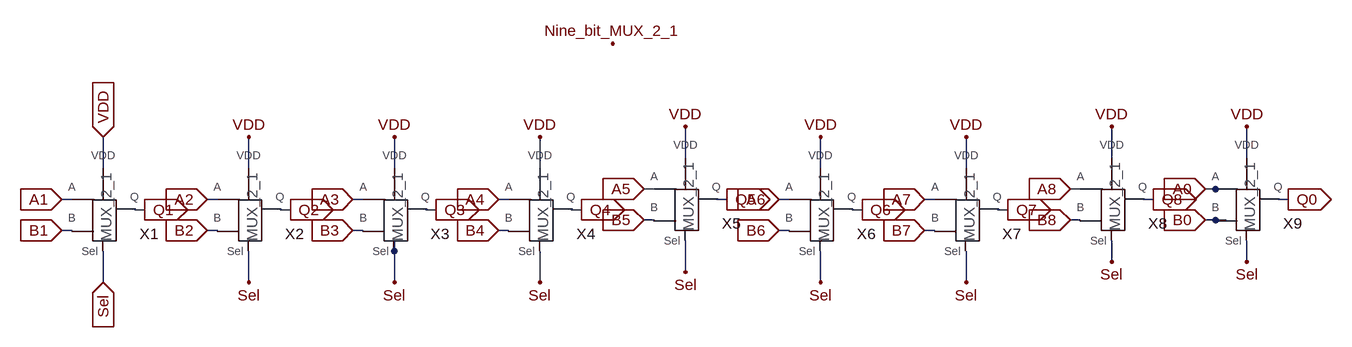
[diagram p0: schematic Mux_2_9bit_1.asc]
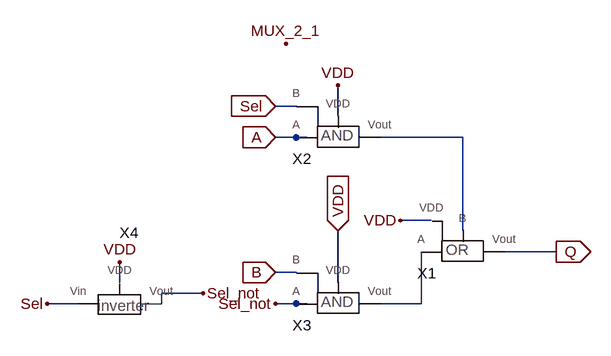
[diagram p1: sub-circuit mux_2_1.asc]
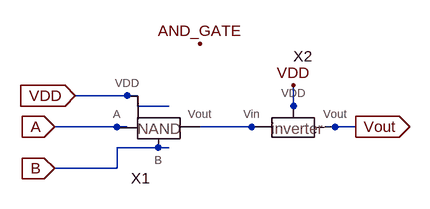
[diagram p2: sub-circuit and_gate.asc]
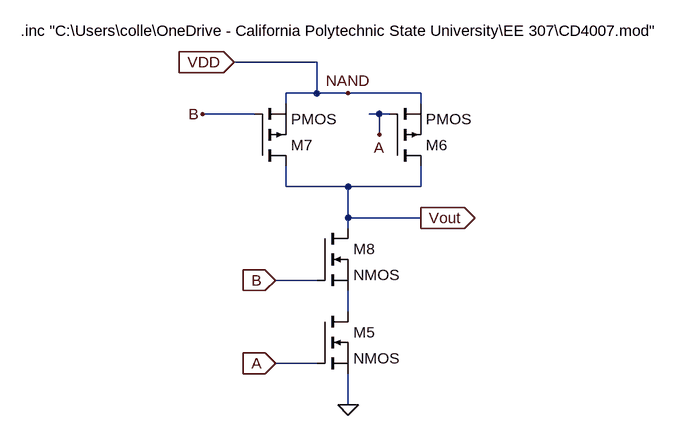
[diagram p3: sub-circuit nand_gate.asc]
Mux_2_9bit_1.asc, the LTspice schematic file:
Version 4
SHEET 1 2028 680
WIRE 1008 -208 1008 -256
WIRE 1664 -208 1664 -256
WIRE 1872 -208 1872 -256
WIRE 112 -192 112 -240
WIRE 336 -192 336 -240
WIRE 560 -192 560 -240
WIRE 784 -192 784 -240
WIRE 1216 -192 1216 -240
WIRE 1440 -192 1440 -240
WIRE 960 -160 944 -160
WIRE 1616 -160 1600 -160
WIRE 1824 -160 1808 -160
WIRE 1840 -160 1824 -160
WIRE 64 -144 48 -144
WIRE 288 -144 272 -144
WIRE 512 -144 496 -144
WIRE 736 -144 720 -144
WIRE 1072 -144 1056 -144
WIRE 1168 -144 1152 -144
WIRE 1392 -144 1376 -144
WIRE 1728 -144 1712 -144
WIRE 1936 -144 1920 -144
WIRE 176 -128 160 -128
WIRE 400 -128 384 -128
WIRE 624 -128 608 -128
WIRE 848 -128 832 -128
WIRE 1280 -128 1264 -128
WIRE 1504 -128 1488 -128
WIRE 960 -112 944 -112
WIRE 1616 -112 1600 -112
WIRE 1824 -112 1808 -112
WIRE 1840 -112 1824 -112
WIRE 64 -96 48 -96
WIRE 288 -96 272 -96
WIRE 512 -96 496 -96
WIRE 736 -96 720 -96
WIRE 1168 -96 1152 -96
WIRE 1392 -96 1376 -96
WIRE 560 -64 560 -80
WIRE 1664 -48 1664 -80
WIRE 1872 -48 1872 -80
WIRE 1008 -32 1008 -80
WIRE 112 -16 112 -64
WIRE 336 -16 336 -64
WIRE 560 -16 560 -64
WIRE 784 -16 784 -64
WIRE 1216 -16 1216 -64
WIRE 1440 -16 1440 -64
FLAG 1872 -256 VDD
FLAG 1664 -256 VDD
FLAG 1440 -240 VDD
FLAG 1216 -240 VDD
FLAG 1008 -256 VDD
FLAG 784 -240 VDD
FLAG 560 -240 VDD
FLAG 336 -240 VDD
FLAG 112 -240 VDD
IOPIN 112 -240 In
FLAG 112 -16 Sel
IOPIN 112 -16 In
FLAG 336 -16 Sel
FLAG 560 -16 Sel
FLAG 784 -16 Sel
FLAG 1008 -32 Sel
FLAG 1216 -16 Sel
FLAG 1440 -16 Sel
FLAG 1664 -48 Sel
FLAG 1872 -48 Sel
FLAG 176 -128 Q1
IOPIN 176 -128 Out
FLAG 400 -128 Q2
IOPIN 400 -128 Out
FLAG 624 -128 Q3
IOPIN 624 -128 Out
FLAG 848 -128 Q4
IOPIN 848 -128 Out
FLAG 1072 -144 Q5
IOPIN 1072 -144 Out
FLAG 1280 -128 Q6
IOPIN 1280 -128 Out
FLAG 1504 -128 Q7
IOPIN 1504 -128 Out
FLAG 1728 -144 Q8
IOPIN 1728 -144 Out
FLAG 1936 -144 Q0
IOPIN 1936 -144 Out
FLAG 48 -144 A1
IOPIN 48 -144 In
FLAG 272 -144 A2
IOPIN 272 -144 In
FLAG 496 -144 A3
IOPIN 496 -144 In
FLAG 720 -144 A4
IOPIN 720 -144 In
FLAG 944 -160 A5
IOPIN 944 -160 In
FLAG 1152 -144 A6
IOPIN 1152 -144 In
FLAG 1376 -144 A7
IOPIN 1376 -144 In
FLAG 1600 -160 A8
IOPIN 1600 -160 In
FLAG 1808 -160 A0
IOPIN 1808 -160 In
FLAG 48 -96 B1
IOPIN 48 -96 In
FLAG 272 -96 B2
IOPIN 272 -96 In
FLAG 496 -96 B3
IOPIN 496 -96 In
FLAG 720 -96 B4
IOPIN 720 -96 In
FLAG 944 -112 B5
IOPIN 944 -112 In
FLAG 1152 -96 B6
IOPIN 1152 -96 In
FLAG 1376 -96 B7
IOPIN 1376 -96 In
FLAG 1600 -112 B8
IOPIN 1600 -112 In
FLAG 1808 -112 B0
IOPIN 1808 -112 In
FLAG 896 -384 Nine_bit_MUX_2_1
SYMBOL MUX_2_1 144 -96 R0
SYMATTR InstName X1
SYMBOL MUX_2_1 368 -96 R0
SYMATTR InstName X2
SYMBOL MUX_2_1 592 -96 R0
SYMATTR InstName X3
SYMBOL MUX_2_1 816 -96 R0
SYMATTR InstName X4
SYMBOL MUX_2_1 1040 -112 R0
SYMATTR InstName X5
SYMBOL MUX_2_1 1248 -96 R0
SYMATTR InstName X6
SYMBOL MUX_2_1 1472 -96 R0
SYMATTR InstName X7
SYMBOL MUX_2_1 1696 -112 R0
SYMATTR InstName X8
SYMBOL MUX_2_1 1904 -112 R0
SYMATTR InstName X9

mux_2_1.asc, the sub-circuit schematic file:
Version 4
SHEET 1 880 680
WIRE -48 -80 -80 -80
WIRE 16 -64 16 -112
WIRE -48 -32 -80 -32
WIRE -32 -32 -48 -32
WIRE 208 -32 80 -32
WIRE 160 96 112 96
WIRE 208 112 208 -32
WIRE 352 144 272 144
WIRE -48 176 -80 176
WIRE -320 192 -320 160
WIRE 16 192 16 112
WIRE -192 208 -256 208
WIRE -384 224 -432 224
WIRE -256 224 -256 208
WIRE -48 224 -80 224
WIRE -32 224 -48 224
WIRE 144 224 144 144
WIRE 144 224 80 224
FLAG 352 144 Q
IOPIN 352 144 Out
FLAG -80 224 Sel_not
FLAG -80 176 B
IOPIN -80 176 In
FLAG -80 -32 A
IOPIN -80 -32 In
FLAG 16 112 VDD
IOPIN 16 112 In
FLAG 16 -112 VDD
FLAG 112 96 VDD
FLAG -80 -80 Sel
IOPIN -80 -80 In
FLAG -432 224 Sel
FLAG -192 208 Sel_not
FLAG -320 160 VDD
FLAG -64 -176 MUX_2_1
SYMBOL OR_gate 240 144 R0
SYMATTR InstName X1
SYMBOL AND_gate 48 -32 R0
SYMATTR InstName X2
SYMBOL AND_gate 48 224 R0
SYMATTR InstName X3
SYMBOL Inverter -288 240 R0
SYMATTR InstName X4

and_gate.asc, the sub-circuit schematic file:
Version 4
SHEET 1 880 680
WIRE 80 128 -16 128
WIRE 80 144 80 128
WIRE 128 144 80 144
WIRE 320 144 320 112
WIRE 320 160 320 144
WIRE 64 176 -48 176
WIRE 192 176 176 176
WIRE 256 176 192 176
WIRE 272 176 256 176
WIRE 384 176 368 176
WIRE 416 176 384 176
WIRE 128 208 48 208
WIRE 48 240 48 208
WIRE 48 240 -48 240
FLAG -16 128 VDD
IOPIN -16 128 In
FLAG -48 176 A
IOPIN -48 176 In
FLAG -48 240 B
IOPIN -48 240 In
FLAG 416 176 Vout
IOPIN 416 176 Out
FLAG 320 112 VDD
FLAG 176 48 AND_GATE
SYMBOL Nand_gate 160 192 R0
SYMATTR InstName X1
SYMBOL Inverter 352 192 R0
SYMATTR InstName X2

nand_gate.asc, the sub-circuit schematic file:
Version 4
SHEET 1 880 680
WIRE -224 -192 -352 -192
WIRE -224 -144 -224 -192
WIRE -224 -144 -272 -144
WIRE -176 -144 -224 -144
WIRE -64 -144 -176 -144
WIRE -272 -128 -272 -144
WIRE -64 -128 -64 -144
WIRE -320 -112 -400 -112
WIRE -128 -112 -144 -112
WIRE -112 -112 -128 -112
WIRE -128 -80 -128 -112
WIRE -272 0 -272 -32
WIRE -176 0 -272 0
WIRE -64 0 -64 -32
WIRE -64 0 -176 0
WIRE -176 48 -176 0
WIRE -64 48 -176 48
WIRE -176 64 -176 48
WIRE -224 144 -288 144
WIRE -176 192 -176 160
WIRE -224 272 -288 272
WIRE -176 336 -176 288
FLAG -176 -144 NAND
FLAG -176 336 0
FLAG -288 272 A
IOPIN -288 272 In
FLAG -128 -80 A
FLAG -400 -112 B
FLAG -288 144 B
IOPIN -288 144 In
FLAG -64 48 Vout
IOPIN -64 48 Out
FLAG -352 -192 VDD
IOPIN -352 -192 In
SYMBOL nmos -224 192 R0
SYMATTR InstName M5
SYMBOL pmos -112 -32 M180
SYMATTR InstName M6
SYMBOL pmos -320 -32 M180
SYMATTR InstName M7
SYMBOL nmos -224 64 R0
SYMATTR InstName M8
TEXT -680 -240 Left 2 !.inc "C:\\Users\\colle\\OneDrive - California Polytechnic State University\\EE 307\\CD4007.mod"

The netlist it stands for:
* Mux_2_9bit_1.asc
XX1 A1 B1 Sel Q1 VDD mux_2_1
XX2 A2 B2 Sel Q2 VDD mux_2_1
XX3 A3 B3 Sel Q3 VDD mux_2_1
XX4 A4 B4 Sel Q4 VDD mux_2_1
XX5 A5 B5 Sel Q5 VDD mux_2_1
XX6 A6 B6 Sel Q6 VDD mux_2_1
XX7 A7 B7 Sel Q7 VDD mux_2_1
XX8 A8 B8 Sel Q8 VDD mux_2_1
XX9 A0 B0 Sel Q0 VDD mux_2_1

* block symbol definitions
.subckt mux_2_1 A B Sel Q VDD
XX1 N002 N001 Q VDD OR_gate  ; pins A B Vout VDD
XX2 A VDD N001 Sel and_gate
XX3 Sel_not VDD N002 B and_gate
XX4 Sel VDD Sel_not Inverter  ; pins Vin VDD Vout
.ends mux_2_1

.subckt and_gate A VDD Vout B
XX1 A B N001 VDD nand_gate
XX2 N001 VDD Vout Inverter  ; pins Vin VDD Vout
.ends and_gate

.subckt nand_gate A B Vout VDD
M5 N001 A 0 0 NMOS
M6 Vout A VDD VDD PMOS
M7 Vout B VDD VDD PMOS
M8 Vout B N001 N001 NMOS
.inc "C:\Users\colle\OneDrive - California Polytechnic State University\EE 307\CD4007.mod"
.ends nand_gate

.model NMOS NMOS
.model PMOS PMOS
.lib standard.mos
.backanno
.end